# Altium project Lombardo.PrjPcb
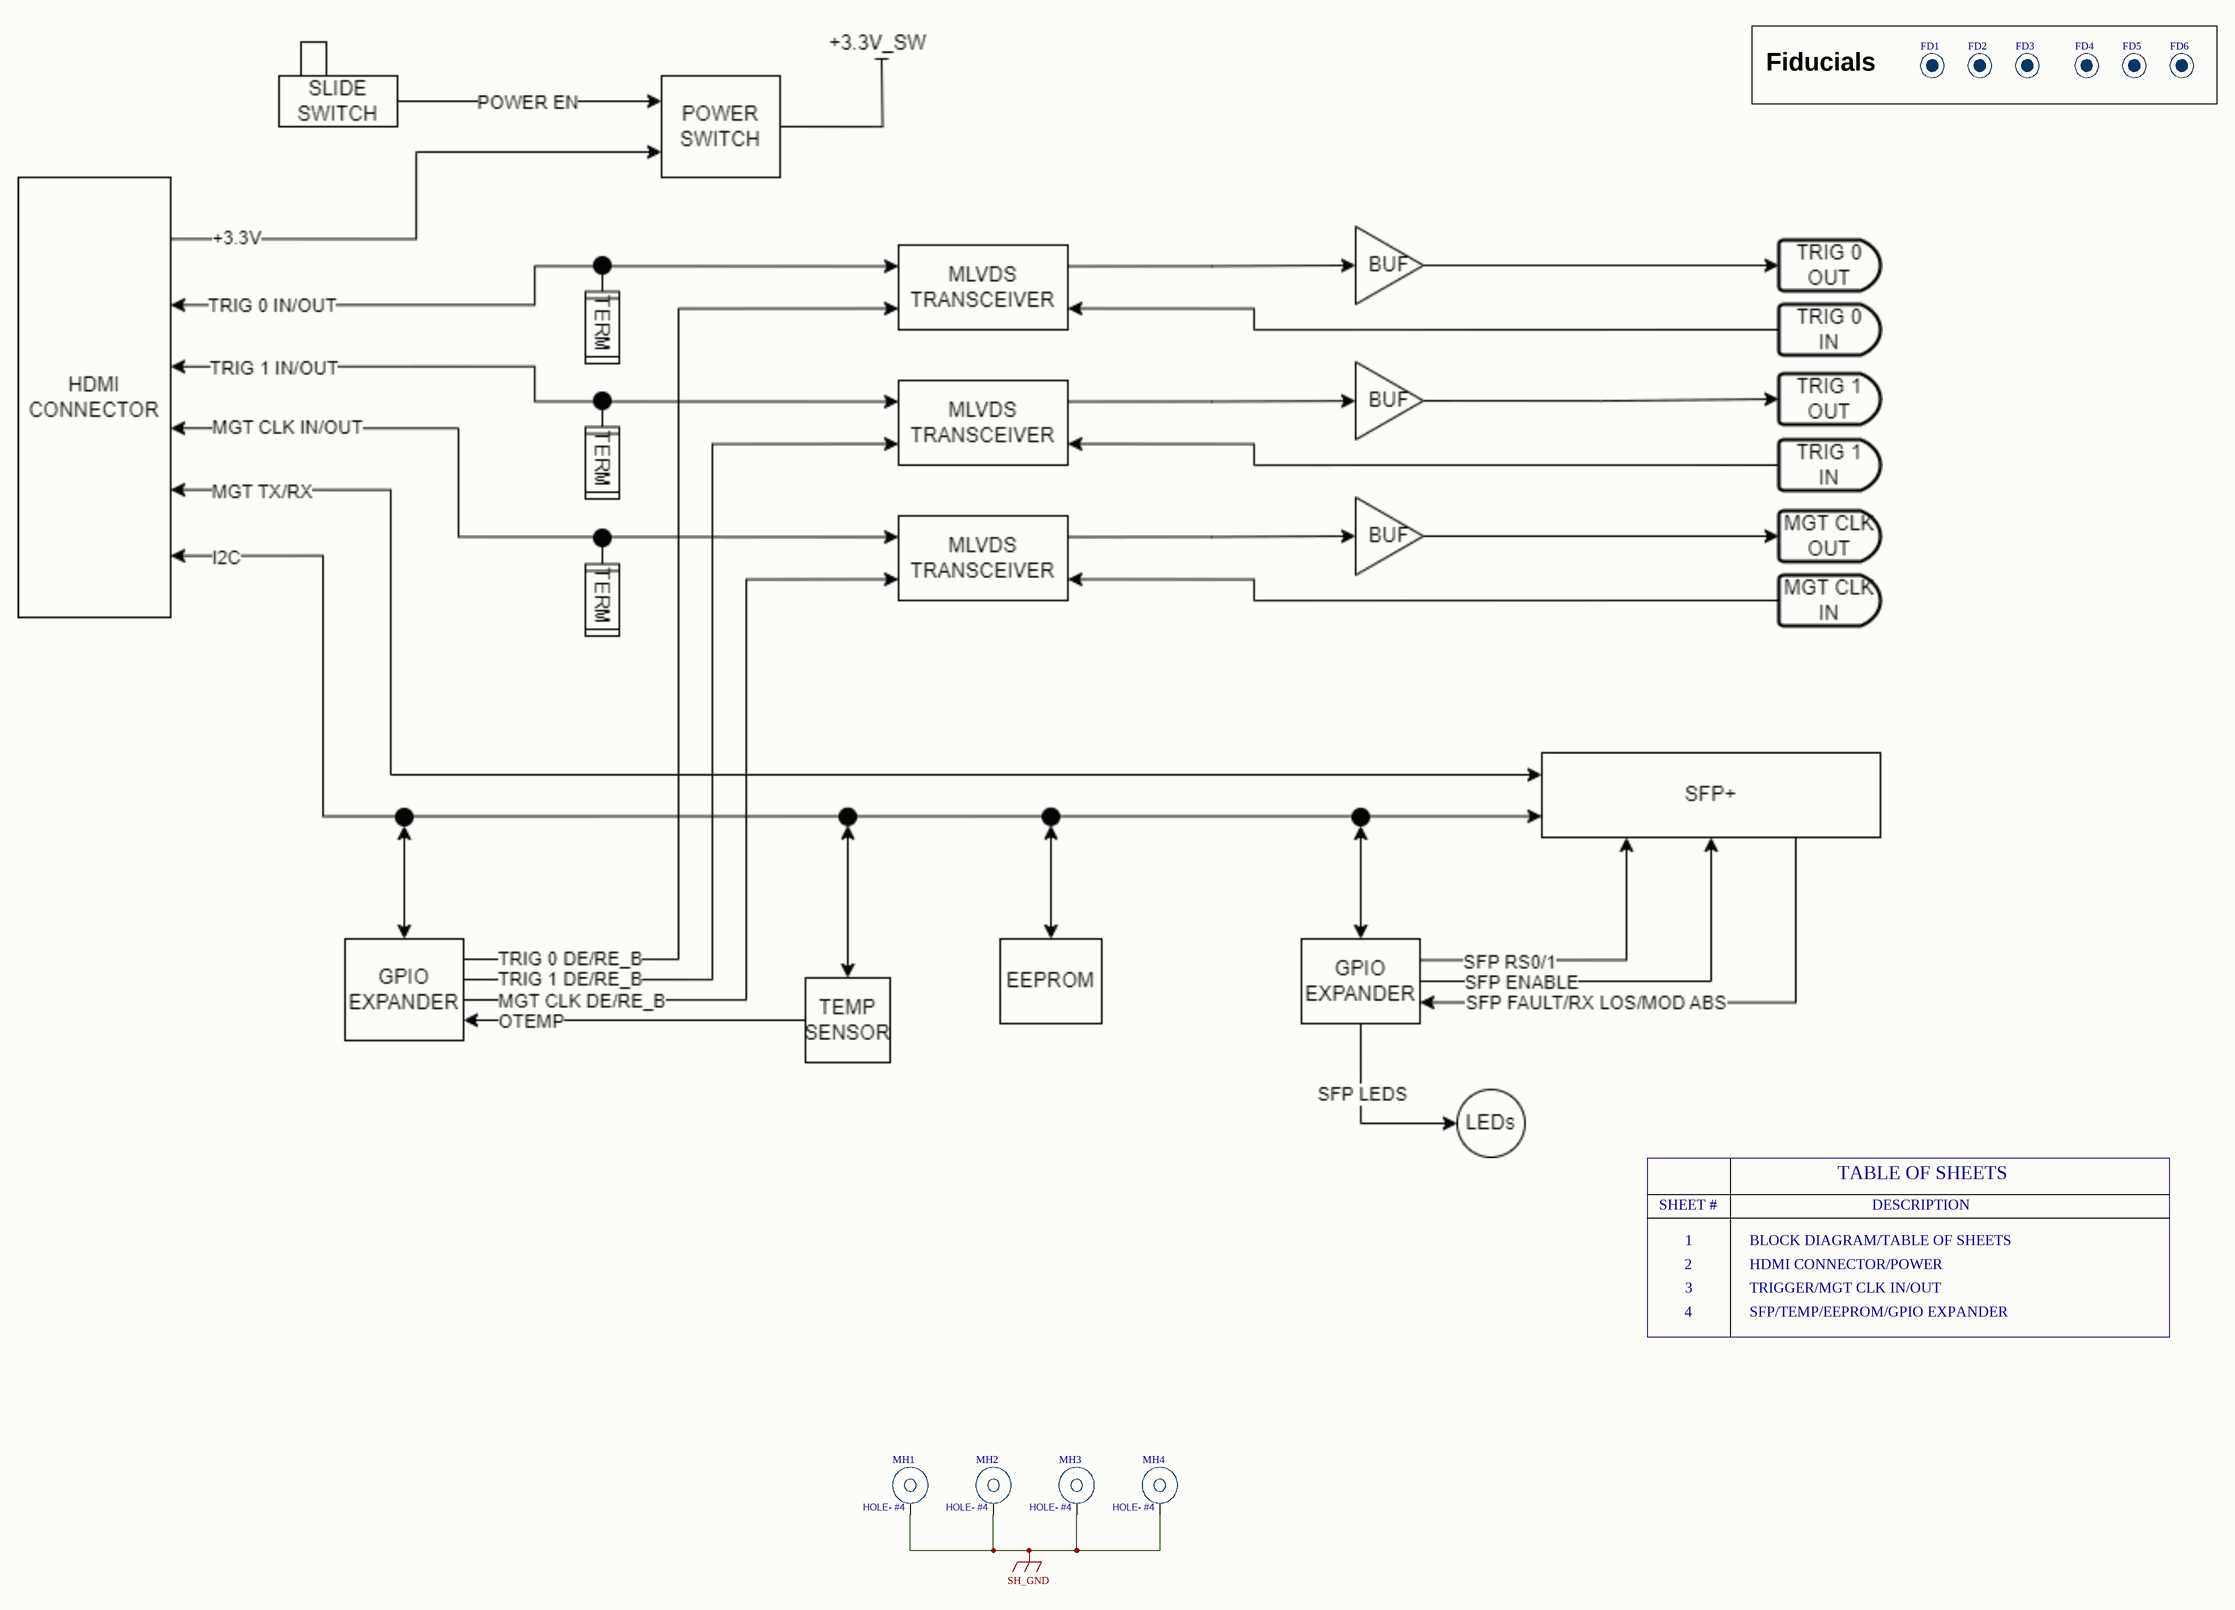
[diagram p0: BLOCK_DIAGRAM_TABLE_OF_SHEETS.SchDoc]
4 sheets, 168 parts. Net scope: global (net labels, ports and power ports of the same name join across sheets).
Board file: Lombardo_RevB.PcbDoc
Sheets:
  BLOCK_DIAGRAM_TABLE_OF_SHEETS.SchDoc
  HDMI_CONN_POWER_IN.SchDoc
  CLOCK_TRIGGER_BUF_SMA.SchDoc
  SFP_TEMP_EEPROM_GPIO.SchDoc

## Sheet BLOCK_DIAGRAM_TABLE_OF_SHEETS.SchDoc: MICRO HDMI INTERFACE
size C; CheckedBy: R. COXE; CompanyName: Atom Computing; DrawnBy: K. BARNES; Engineer: K. BARNES; Organization: Atom Computing Inc.; Address1: 918 Parker St.; Address2: Suite A-13; Address3: Berkeley, CA; Address4: 94710; DocumentNumber: 2020-07-02; Revision: B.2; SheetNumber: 1; SheetTotal: 4; PageSetup: Record=PageOptions|CenterHorizontal=True|CenterVertical=True|PrintScale=1.09|XCorrection=1.00|YCorrection=1.00|PrintKind=1|BorderSize=5000000|LeftOffset=0|BottomOffset=0|Orientation=2|PaperLength=4318|PaperWidth=2794|Scale=100|PaperSource=1025|PrintQuality=600|MediaType=256|DitherType=0|PrintScaleMode=1|PaperKind=11" x 17"|PaperIndex=17; Size: C; ReleaseYear: 2024; BoardTitle: MICRO HDMI INTERFACE; DateDrawn: 04/18/2024; DateENG: 04/18/2024; Approved1: R. COXE; DateChecked: 04/18/2024; DescriptionA: ENGINEERING RELEASE; DescriptionB: SWAP SCL/SDA ON U10, INCREASE R39 VALUE; ApprovedA: R. COXE; ApprovedB: R. COXE; DateRevisionA: 04/18/2024; DateRevisionB: 08/28/2024; RevisionA: A; RevisionB: B.1; DescriptionC: CHANGED U8 TO MAC VERSION; RevisionC: B.2; DateRevisionC: 09/26/2024; ApprovedC: R. COXE

### Parts
FD1  FIDUCIAL  [FIDUCIAL-GT]  (value not drawn)  (no BOM)
FD2  FIDUCIAL  [FIDUCIAL-GT]  (value not drawn)  (no BOM)
FD3  FIDUCIAL  [FIDUCIAL-GT]  (value not drawn)  (no BOM)
FD4  FIDUCIAL  [FIDUCIAL-GT]  (value not drawn)  (no BOM)
FD5  FIDUCIAL  [FIDUCIAL-GT]  (value not drawn)  (no BOM)
FD6  FIDUCIAL  [FIDUCIAL-GT]  (value not drawn)  (no BOM)
MH1  HOLE- #4  [HOLE - #4 screw]  (no BOM)
MH2  HOLE- #4  [HOLE - #4 screw]  (no BOM)
MH3  HOLE- #4  [HOLE - #4 screw]  (no BOM)
MH4  HOLE- #4  [HOLE - #4 screw]  (no BOM)

### Blocks framed on the sheet
Fiducials: FD1-FD6

### Nets
SH_GND: MH1.1(GND) MH2.1(GND) MH3.1(GND) MH4.1(GND)

### Notes on the sheet
- TABLE OF SHEETS
- SHEET #
- DESCRIPTION
- 2
- 3
- 1
- TRIGGER/MGT CLK IN/OUT
- HDMI CONNECTOR/POWER
- BLOCK DIAGRAM/TABLE OF SHEETS
- 4
- SFP/TEMP/EEPROM/GPIO EXPANDER
- REV
- REVISIONS
- DATE
- APPROVED
- ,
- DRAWN
- ENG
- SCHEMATIC,
- "This documentation describes Open Hardware and is licensed under the CC BY-SA 4.0. You may redistribute and modify this documentation under the terms of
- CC BY-SA 4.0. (https://creativecommons.org/licenses/by-sa/4.0/). This documentation is distributed WITHOUT ANY EXPRESS OR IMPLIED WARRANTY,
- INCLUDING OF MERCHANTABILITY, SATISFACTORY QUALITY AND FITNESS FOR A PARTICULAR PURPOSE."  COPYRIGHT ©
- Atom Computing, Inc.
- CHKD
- SIZE
- FILE NAME
- PAGE
- OF

### Library data of the parts
FD1-FD6 = CMP-00028-00000-3: Mfg: PCB FEATURE; Pins: 0; Mfg PN: FIDUCIAL
MH1-MH4 = CMP-028-00002-1: Mounting Hole for #4 screw; Mfg: NA; Case/Package: #4; Pins: 1; Mfg PN: HOLE

## Sheet HDMI_CONN_POWER_IN.SchDoc
size C; CompanyName: Atom Computing; Organization: Altium Limited; Address1: 918 Parker St.; Address2: Suite A-13; Address3: Berkeley, CA; Address4: 94710; Revision: B.2; SheetNumber: 2; SheetTotal: 4; PageSetup: Record=PageOptions|CenterHorizontal=True|CenterVertical=True|PrintScale=1.09|XCorrection=1.00|YCorrection=1.00|PrintKind=1|BorderSize=5000000|LeftOffset=0|BottomOffset=0|Orientation=2|PaperLength=4318|PaperWidth=2794|Scale=100|PaperSource=1025|PrintQuality=600|MediaType=256|DitherType=0|PrintScaleMode=1|PaperKind=11" x 17"|PaperIndex=17; Size: C; DescriptionA: ENGINEERING RELEASE; ReleaseYear: 2024; BoardTitle: MICRO HDMI INTERFACE
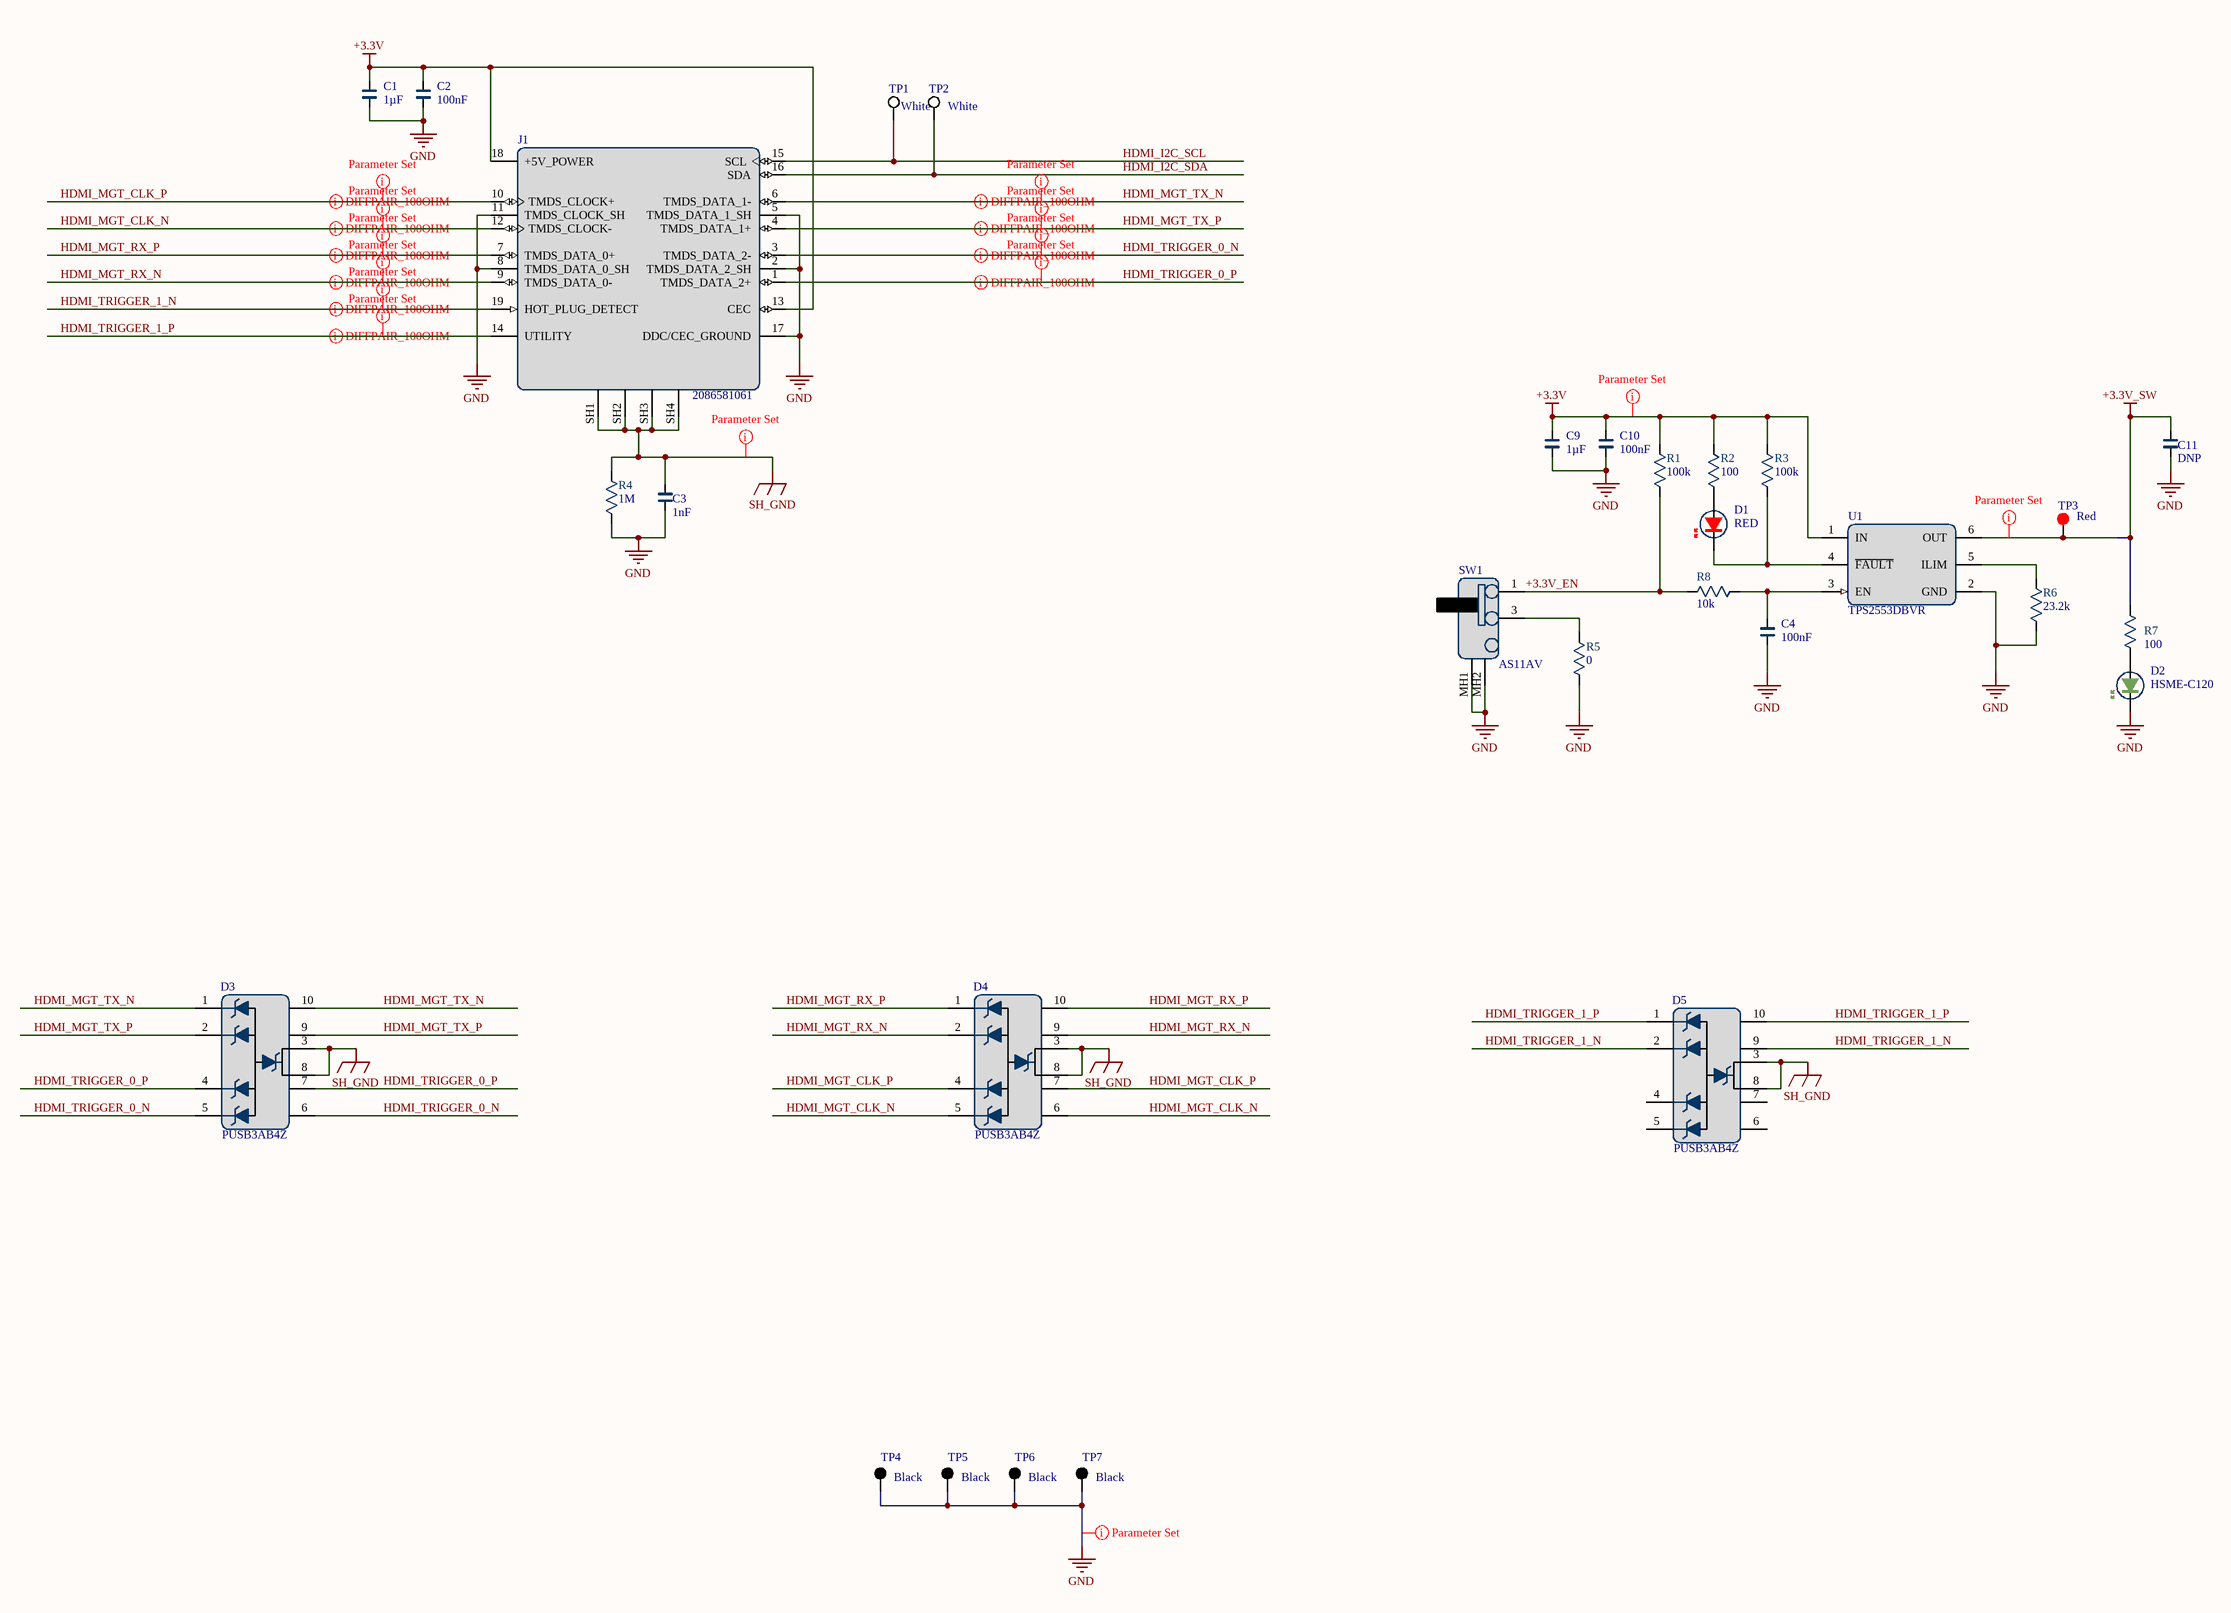
[diagram p1: HDMI_CONN_POWER_IN.SchDoc]

### Parts
C1  1µF  [CAPC160X80X95L35]
C2  100nF  [CAPC160X80X95L35]
C3  1nF  [CAPC160X80X95L35]
C4  100nF  [CAPC160X80X95L35]
C9  1µF  [CAPC160X80X95L35]
C10  100nF  [CAPC160X80X95L35]
C11  DNP  [CAPC200X125X145L50]
D1  RED  [LEDSC80X160X55L40X70_C1A2]
D2  HSME-C120  [BROADCOM_HSMX-C120]
D3  PUSB3AB4Z  [NEXPERIA_PUSB3AB4Z]
D4  PUSB3AB4Z  [NEXPERIA_PUSB3AB4Z]
D5  PUSB3AB4Z  [NEXPERIA_PUSB3AB4Z]
J1  2086581061  [MOLEX_2086581061]
R1  100k  [RESC160X85X55L30]
R2  100  [RESC160X85X55L30]
R3  100k  [RESC160X85X55L30]
R4  1M  [RESC320X160X76L51]
R5  0  [RESC160X85X55L30]
R6  23.2k  [RESC160X85X55L30]
R7  100  [RESC160X85X55L30]
R8  10k  [RESC160X85X55L30]
SW1  AS11AV  [AS11AV]
TP1  White  [Keystone_5002]
TP2  White  [Keystone_5002]
TP3  Red  [Keystone_5000]
TP4  Black  [Keystone_5001]
TP5  Black  [Keystone_5001]
TP6  Black  [Keystone_5001]
TP7  Black  [Keystone_5001]
U1  TPS2553DBVR  [SOT23-6P95_280X145L45X37]

### Nets
+3.3V: C1.1 C2.1 C9.1 C10.1 J1.13(CEC) J1.18(+5V_POWER) R1.2 R2.2 R3.2 U1.1(IN)
+3.3V_SW: C11.1 R7.2 TP3.1 U1.6(OUT)
GND: C1.2 C2.2 C3.2 C4.2 C9.2 C10.2 C11.2 D2.1 J1.2(TMDS_DATA_2_SH) J1.5(TMDS_DATA_1_SH) J1.8(TMDS_DATA_0_SH) J1.11(TMDS_CLOCK_SH) J1.17(DDC/CEC_GROUND) R4.1 R5.2 R6.1 SW1.MH1(P4) SW1.MH2(P5) TP4.1 TP5.1 TP6.1 TP7.1 U1.2(GND)
SH_GND: C3.1 D3.3 D3.8 D4.3 D4.8 D5.3 D5.8 J1.SH1(SHLD1) J1.SH2(SHLD2) J1.SH3(SHLD3) J1.SH4(SHLD4) R4.2
+3.3V_EN: R1.1 R8.1 SW1.1(P1)
HDMI_I2C_SCL: J1.15(SCL) TP1.1
HDMI_I2C_SDA: J1.16(SDA) TP2.1
HDMI_MGT_CLK_N: D4.5 D4.6 J1.12(TMDS_CLOCK-)
HDMI_MGT_CLK_P: D4.4 D4.7 J1.10(TMDS_CLOCK+)
HDMI_MGT_RX_N: D4.2 D4.9 J1.9(TMDS_DATA_0-)
HDMI_MGT_RX_P: D4.1 D4.10 J1.7(TMDS_DATA_0+)
HDMI_MGT_TX_N: D3.1 D3.10 J1.6(TMDS_DATA_1-)
HDMI_MGT_TX_P: D3.2 D3.9 J1.4(TMDS_DATA_1+)
HDMI_TRIGGER_0_N: D3.5 D3.6 J1.3(TMDS_DATA_2-)
HDMI_TRIGGER_0_P: D3.4 D3.7 J1.1(TMDS_DATA_2+)
HDMI_TRIGGER_1_N: D5.2 D5.9 J1.19(HOT_PLUG_DETECT)
HDMI_TRIGGER_1_P: D5.1 D5.10 J1.14(UTILITY)
NetC4_1: C4.1 R8.2 U1.3(EN)
NetD1_1: D1.1 R3.1 U1.4(~{FAULT})
NetD1_2: D1.2 R2.1
NetD2_2: D2.2 R7.1
NetR5_1: R5.1 SW1.3(P3)
NetR6_2: R6.2 U1.5(ILIM)

Not connected (* = marked no-connect by the designer): D5 4 5 6 7

### Layout directives
differential pair; differential pair class 100DIFF: HDMI_MGT_CLK_N, HDMI_MGT_CLK_P, HDMI_MGT_RX_N, HDMI_MGT_RX_P, HDMI_MGT_TX_N, HDMI_MGT_TX_P, HDMI_TRIGGER_0_N, HDMI_TRIGGER_0_P, HDMI_TRIGGER_1_N, HDMI_TRIGGER_1_P
net class P-G: +3.3V, +3.3V_SW, GND, SH_GND
rule Signal Stimulus [Kind - Periodic Pulse    Level - Low    Start Time = 20.00n    Stop Time = 500.0n    Period Time = 200.0n]; net class DIFFP: HDMI_MGT_CLK_P, HDMI_MGT_RX_P, HDMI_MGT_TX_P, HDMI_TRIGGER_0_P, HDMI_TRIGGER_1_P
rule Signal Stimulus [Kind - Periodic Pulse    Level - High    Start Time = 20.00n    Stop Time = 500.0n    Period Time = 200.0n]; net class DIFFN: HDMI_MGT_CLK_N, HDMI_MGT_RX_N, HDMI_MGT_TX_N, HDMI_TRIGGER_0_N, HDMI_TRIGGER_1_N

### Notes on the sheet
- SCHEMATIC,
- "This documentation describes Open Hardware and is licensed under the CC BY-SA 4.0. You may redistribute and modify this documentation under the terms of
- CC BY-SA 4.0. (https://creativecommons.org/licenses/by-sa/4.0/). This documentation is distributed WITHOUT ANY EXPRESS OR IMPLIED WARRANTY,
- INCLUDING OF MERCHANTABILITY, SATISFACTORY QUALITY AND FITNESS FOR A PARTICULAR PURPOSE."  COPYRIGHT ©
- Atom Computing, Inc.
- ,
- SIZE
- FILE NAME
- PAGE
- OF
- REV

### Library data of the parts
C1 C9 = CMP-001-00135-7: CAP CER 1uF 10V 10% 0603; Op Temp: -55°C ~ 85°C; Mfg PN: C0603C105K8PACTU; Temp Coeff: X5R; Mfg: Kemet; VALUE: 1µF; Voltage: 10V; Tolerance: 10%; Case/Package: 0603; Pins: 2
C2 C4 C10 = CMP-001-00143-7: CAP CER 0.1UF 25V X7R 0603; Tolerance: 10%; Mfg: Kemet; Mfg PN: C0603X104K3RACTU; Voltage: 25V; Temp Coeff: X7R; Case/Package: 0603; VALUE: 100nF; Pins: 2
C3 = CMP-001-00209-7: CAP CER 1000PF 50V C0G/NPO 0603; Temp Coeff: C0G/NP0; Tolerance: 5%; Mfg: Yageo; Mfg PN: CC0603JRNPO9BN102; Voltage: 50V; Case/Package: 0603; Pins: 2; VALUE: 1nF
C11 = CMP-001-00017-8: DNP, CAP 0805; VALUE: 100p; Mfg PN: DNP_CAP_0805; Mfg: DNP; Case/Package: 0805; Pins: 2
D1 = CMP-004-00024-2: LED RED CLEAR CHIP SMD 629nm, 1.9V, 0603; Mfg PN: LTST-C193KRKT-2A; Mfg: Lite-On Inc.; Current Rating: 30mA; Voltage: 2V; Op Temp: -55°C ~ 85°C; Value: RED; Pins: 2; Case/Package: 0603
D2 = CMP-004-00020-5: LED GREEN CLEAR CHIP SMD R/A; Mfg: AVAGO TECHNOLOGIES; Forward Voltage: 2.1V; Mfg PN: HSME-C120; Value: GREEN; Pins: 2; Case/Package: 2-SMD; Mounting Technology: Surface Mount; Nominal Vf: 2.1V; RoHS Compliant: Yes
D3-D5 = CMP-0037-00001-1: TVS DIODE BIDIRECTIONAL 3.3VWM 5VC DFN2510A-10; Mfg: Nexperia USA Inc.; Voltage - Clamping: 5V; Current - Peak Pulse: 7A (8/20µs); Voltage - Reverse Standoff: 3.3V; Voltage - Breakdown: 5.5V; Max Operating Temperature: 85°C; Pins: 10; Mounting Technology: Surface Mount; Mfg PN: PUSB3AB4Z; Case/Package: 10-XFDFN; RoHS Compliant: Yes; Min Operating Temperature: -40°C
J1 = CMP-002-00061-4: HDMI 2.1 Receptacle Connector 19 Position Surface Mount, Right Angle; Through Hole; Mfg: Molex; Max Current Rating: 500mA; Voltage Rating: 40V; Gender: Female; Pins: 23; RoHS Compliant: Yes; Mfg PN: 2086581061; Min Operating Temperature: -20°C; Max Operating Temperature: 85°C; Case/Package: SMD-RA; Mounting Technology: Surface Mount/Through Hole; Connector Type: HDMI
R1 = CMP-009-00291-2: RES SMD 100K OHM 1% 1/10W 0603; Mfg PN: RC0603FR-07100KL; Mfg: Yageo; Case/Package: 0603; VALUE: 100k; Pins: 2
R2 R7 = CMP-009-00467-2: RES SMD 100 OHM 1% 1/10W 0603; Mfg PN: ERJ-3EKF1000V; Mfg: Panasonic Electronic Components; Power: 100mW; VALUE: 100; Tolerance: 1%; Max Operating Temperature: 155°C; Case/Package: 0603; RoHS Compliant: Yes; Pins: 2; Min Operating Temperature: -55°C; Mounting Technology: Surface Mount
R3 = CMP-009-00291-2: RES SMD 100K OHM 1% 1/10W 0603; Mfg: Yageo; Mfg PN: RC0603FR-07100KL; Pins: 2; VALUE: 100k; Case/Package: 0603
R4 = CMP-009-00313-1: 1 ±1% 0.25W, 1/4W Chip Resistor 1206 (3216 Metric) High Voltage Thick Film; Mfg PN: RCV12061M00FKEA; Mfg: Vishay Dale; VALUE: 1M; Case/Package: 1206; Pins: 2
R5 = CMP-009-00290-2: RES 0 OHM JUMPER 1/10W 0603; Mfg PN: RC0603FR-070RL; Mfg: Yageo; Case/Package: 0603; VALUE: 0; Pins: 2
R6 = CMP-009-00553-1: RES SMD 23.2K OHM 1% 1/10W 0603; Power: 100mW; Mfg: Panasonic Electronic Components; Mfg PN: ERJ-3EKF2322V; VALUE: 23.2k; Tolerance: 1%; Pins: 2; Min Operating Temperature: -55°C; RoHS Compliant: Yes; Max Operating Temperature: 155°C; Case/Package: 0603; Mounting Technology: Surface Mount
R8 = CMP-009-00475-2: RES SMD 10K OHM 1% 1/10W 0603; Mfg: Panasonic Electronic Components; Mfg PN: ERJ-3EKF1002V; Power: 100mW; VALUE: 10k; Case/Package: 0603; RoHS Compliant: Yes; Pins: 2; Max Operating Temperature: 155°C; Min Operating Temperature: -55°C; Tolerance: 1%; Mounting Technology: Surface Mount
SW1 = CMP-011-00000-3: SWITCH SLIDE SPST 0.4VA 28V Through Hole, Right Angle, Vertical; Mfg: NKK Switches; Op Temp: -30°C ~ 85°C; Current Rating: 100mA; Pins: 3; Mfg PN: AS11AV; Case/Package: .100" TH-RA; Voltage: 28V
TP1 TP2 = CMP-00030-00002-6: Test Point, White, 1-Pin THD, RoHS, Bulk; Mfg PN: 5002; Mfg: Keystone; Pins: 1; Value: White
TP3 = CMP-00030-00000-6: Test Point, Red, 1-Pin THD, RoHS, Bulk; Mfg: Keystone; Mfg PN: 5000; Value: Red; Pins: 1
TP4-TP7 = CMP-00030-00001-5: Test Point, Black, 1-Pin THD, RoHS, Bulk; Mfg PN: 5001; Mfg: Keystone; Value: Black; Pins: 1
U1 = CMP-035-00004-3: Power Switch/Driver 1:1 N-Channel 1.5A SOT-23-6; Min Supply Voltage: 2.5V; Max Supply Voltage: 6.5V; Mfg: Texas Instruments; RoHS Compliant: Yes; Mfg PN: TPS2553DBVR; Pins: 6; Output Current: 1.5A; Mounting Technology: Surface Mount; Case/Package: SOT-23-6; Max Operating Temperature: 85°C; Min Operating Temperature: -40°C

## Sheet CLOCK_TRIGGER_BUF_SMA.SchDoc
size C; CompanyName: Atom Computing; Organization: Altium Limited; Address1: 918 Parker St.; Address2: Suite A-13; Address3: Berkeley, CA; Address4: 94710; Revision: B.2; SheetNumber: 3; SheetTotal: 4; PageSetup: Record=PageOptions|CenterHorizontal=True|CenterVertical=True|PrintScale=1.09|XCorrection=1.00|YCorrection=1.00|PrintKind=1|BorderSize=5000000|LeftOffset=0|BottomOffset=0|Orientation=2|PaperLength=4318|PaperWidth=2794|Scale=100|PaperSource=1025|PrintQuality=600|MediaType=256|DitherType=0|PrintScaleMode=1|PaperKind=11" x 17"|PaperIndex=17; Size: C; DescriptionA: ENGINEERING RELEASE; ReleaseYear: 2024; BoardTitle: MICRO HDMI INTERFACE
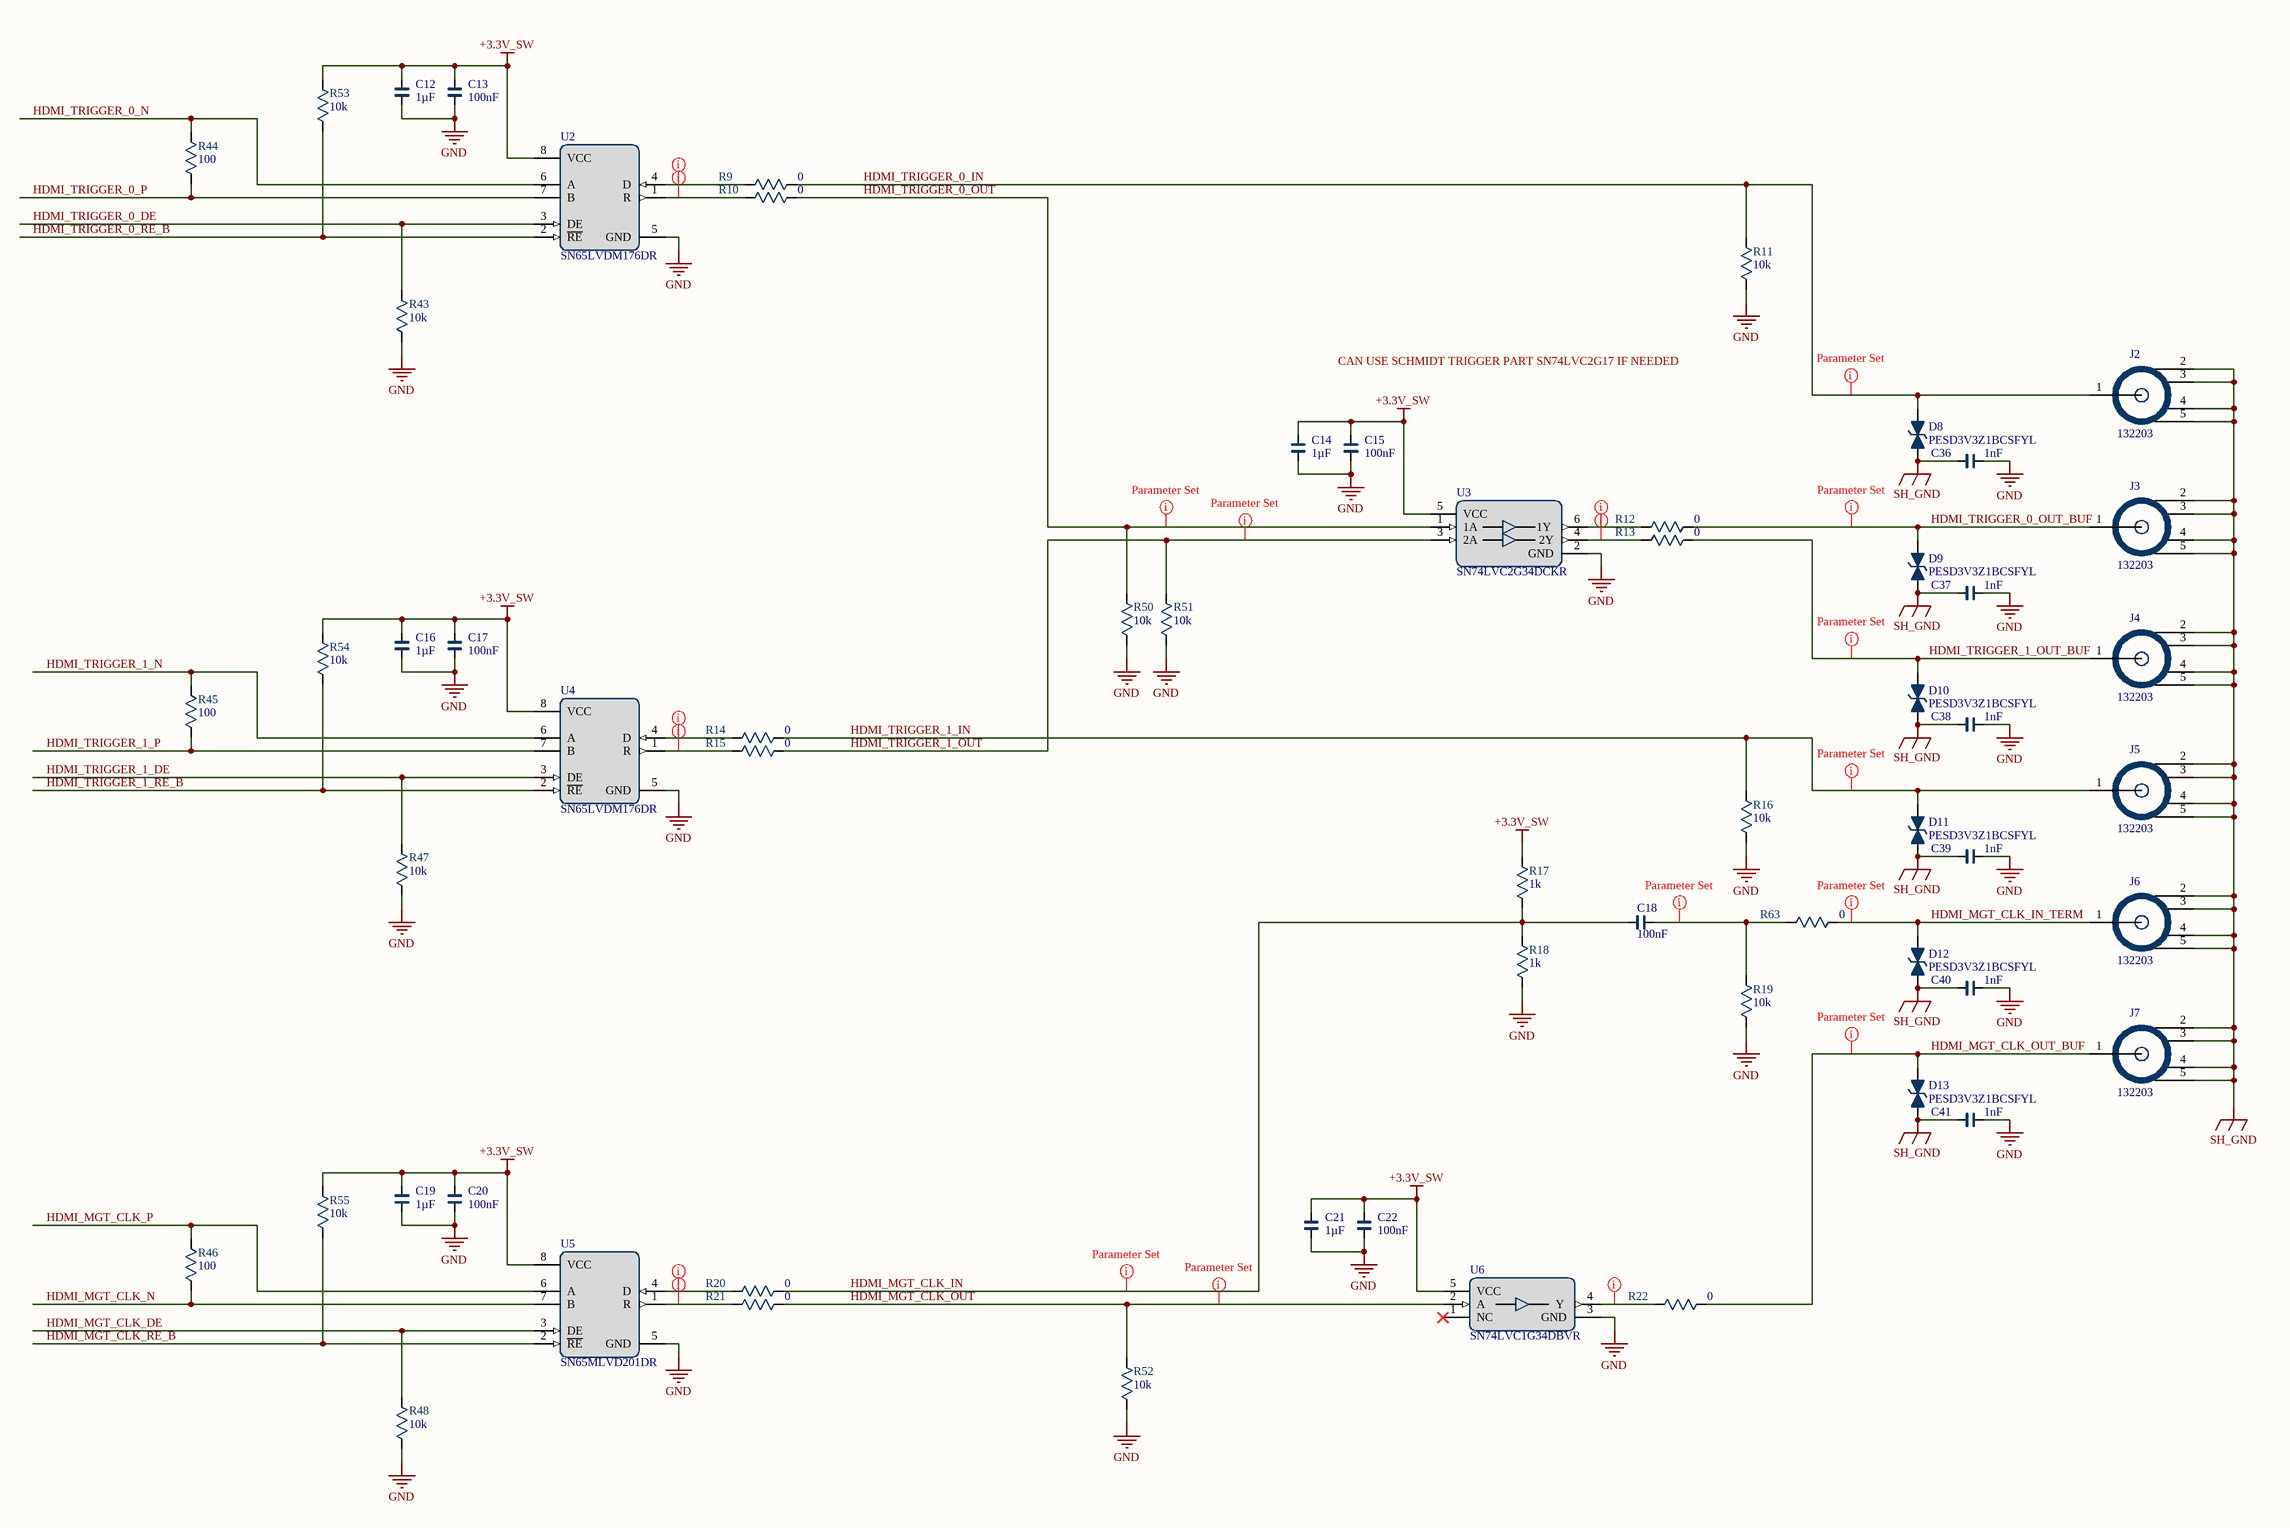
[diagram p2: CLOCK_TRIGGER_BUF_SMA.SchDoc]

### Parts
C12  1µF  [CAPC160X80X95L35]
C13  100nF  [CAPC160X80X95L35]
C14  1µF  [CAPC160X80X95L35]
C15  100nF  [CAPC160X80X95L35]
C16  1µF  [CAPC160X80X95L35]
C17  100nF  [CAPC160X80X95L35]
C18  100nF  [CAPC160X80X95L35]
C19  1µF  [CAPC160X80X95L35]
C20  100nF  [CAPC160X80X95L35]
C21  1µF  [CAPC160X80X95L35]
C22  100nF  [CAPC160X80X95L35]
C36  1nF  [CAPC160X80X95L35]
C37  1nF  [CAPC160X80X95L35]
C38  1nF  [CAPC160X80X95L35]
C39  1nF  [CAPC160X80X95L35]
C40  1nF  [CAPC160X80X95L35]
C41  1nF  [CAPC160X80X95L35]
D8  PESD3V3Z1BCSFYL  [DIO_PESD5V0R1BSFYL]
D9  PESD3V3Z1BCSFYL  [DIO_PESD5V0R1BSFYL]
D10  PESD3V3Z1BCSFYL  [DIO_PESD5V0R1BSFYL]
D11  PESD3V3Z1BCSFYL  [DIO_PESD5V0R1BSFYL]
D12  PESD3V3Z1BCSFYL  [DIO_PESD5V0R1BSFYL]
D13  PESD3V3Z1BCSFYL  [DIO_PESD5V0R1BSFYL]
J2  132203  [Amphenol_132203]
J3  132203  [Amphenol_132203]
J4  132203  [Amphenol_132203]
J5  132203  [Amphenol_132203]
J6  132203  [Amphenol_132203]
J7  132203  [Amphenol_132203]
R9  0  [RESC160X85X55L30]
R10  0  [RESC160X85X55L30]
R11  10k  [RESC160X85X55L30]
R12  0  [RESC160X85X55L30]
R13  0  [RESC160X85X55L30]
R14  0  [RESC160X85X55L30]
R15  0  [RESC160X85X55L30]
R16  10k  [RESC160X85X55L30]
R17  1k  [RESC160X85X55L30]
R18  1k  [RESC160X85X55L30]
R19  10k  [RESC160X85X55L30]
R20  0  [RESC160X85X55L30]
R21  0  [RESC160X85X55L30]
R22  0  [RESC160X85X55L30]
R43  10k  [RESC160X85X55L30]
R44  100  [RESC160X85X55L30]
R45  100  [RESC160X85X55L30]
R46  100  [RESC160X85X55L30]
R47  10k  [RESC160X85X55L30]
R48  10k  [RESC160X85X55L30]
R50  10k  [RESC160X85X55L30]
R51  10k  [RESC160X85X55L30]
R52  10k  [RESC160X85X55L30]
R53  10k  [RESC160X85X55L30]
R54  10k  [RESC160X85X55L30]
R55  10k  [RESC160X85X55L30]
R63  0  [RESC160X85X55L30]
U2  SN65LVDM176DR  [SOIC8P127_490X599X175L84X41]
U3  SN74LVC2G34DCKR  [SOT23-6P65_210X110L36X23]
U4  SN65LVDM176DR  [SOIC8P127_490X599X175L84X41]
U5  SN65MLVD201DR  [SOIC8P127_490X599X175L84X41]
U6  SN74LVC1G34DBVR  [SOT23-5P95_280X110L45X40]

### Nets
+3.3V_SW: C12.1 C13.1 C14.1 C15.1 C16.1 C17.1 C19.1 C20.1 C21.1 C22.1 R17.2 R53.2 R54.2 R55.2 U2.8(VCC) U3.5(VCC) U4.8(VCC) U5.8(VCC) U6.5(VCC)
GND: C12.2 C13.2 C14.2 C15.2 C16.2 C17.2 C19.2 C20.2 C21.2 C22.2 C36.1 C37.1 C38.1 C39.1 C40.1 C41.1 R11.1 R16.1 R18.1 R19.1 R43.1 R47.1 R48.1 R50.1 R51.1 R52.1 U2.5(GND) U3.2(GND) U4.5(GND) U5.5(GND) U6.3(GND)
SH_GND: C36.2 C37.2 C38.2 C39.2 C40.2 C41.2 D8.1 D9.1 D10.1 D11.1 D12.1 D13.1 J2.2(GND) J2.3(GND) J2.4(GND) J2.5(GND) J3.2(GND) J3.3(GND) J3.4(GND) J3.5(GND) J4.2(GND) J4.3(GND) J4.4(GND) J4.5(GND) J5.2(GND) J5.3(GND) J5.4(GND) J5.5(GND) J6.2(GND) J6.3(GND) J6.4(GND) J6.5(GND) J7.2(GND) J7.3(GND) J7.4(GND) J7.5(GND)
HDMI_MGT_CLK_DE: R48.2 U5.3(DE)
HDMI_MGT_CLK_IN: C18.1 R17.1 R18.2 R20.2
HDMI_MGT_CLK_IN_TERM: D12.2 J6.1(RF) R63.2
HDMI_MGT_CLK_N: R46.1 U5.7(B)
HDMI_MGT_CLK_OUT: R21.2 R52.2 U6.2(A)
HDMI_MGT_CLK_OUT_BUF: D13.2 J7.1(RF) R22.2
HDMI_MGT_CLK_P: R46.2 U5.6(A)
HDMI_MGT_CLK_RE_B: R55.1 U5.2(~{RE})
HDMI_TRIGGER_0_DE: R43.2 U2.3(DE)
HDMI_TRIGGER_0_IN: D8.2 J2.1(RF) R9.2 R11.2
HDMI_TRIGGER_0_N: R44.2 U2.6(A)
HDMI_TRIGGER_0_OUT: R10.2 R50.2 U3.1(1A)
HDMI_TRIGGER_0_OUT_BUF: D9.2 J3.1(RF) R12.2
HDMI_TRIGGER_0_P: R44.1 U2.7(B)
HDMI_TRIGGER_0_RE_B: R53.1 U2.2(~{RE})
HDMI_TRIGGER_1_DE: R47.2 U4.3(DE)
HDMI_TRIGGER_1_IN: D11.2 J5.1(RF) R14.2 R16.2
HDMI_TRIGGER_1_N: R45.2 U4.6(A)
HDMI_TRIGGER_1_OUT: R15.2 R51.2 U3.3(2A)
HDMI_TRIGGER_1_OUT_BUF: D10.2 J4.1(RF) R13.2
HDMI_TRIGGER_1_P: R45.1 U4.7(B)
HDMI_TRIGGER_1_RE_B: R54.1 U4.2(~{RE})
NetC18_2: C18.2 R19.2 R63.1
NetR9_1: R9.1 U2.4(D)
NetR10_1: R10.1 U2.1(R)
NetR12_1: R12.1 U3.6(1Y)
NetR13_1: R13.1 U3.4(2Y)
NetR14_1: R14.1 U4.4(D)
NetR15_1: R15.1 U4.1(R)
NetR20_1: R20.1 U5.4(D)
NetR21_1: R21.1 U5.1(R)
NetR22_1: R22.1 U6.4(Y)

Not connected (* = marked no-connect by the designer): U6 1(NC)*

### Layout directives
net class 50OHM: HDMI_MGT_CLK_IN, HDMI_MGT_CLK_IN_TERM, HDMI_MGT_CLK_OUT, HDMI_MGT_CLK_OUT_BUF, HDMI_TRIGGER_0_IN, HDMI_TRIGGER_0_OUT, HDMI_TRIGGER_0_OUT_BUF, HDMI_TRIGGER_1_IN, HDMI_TRIGGER_1_OUT, HDMI_TRIGGER_1_OUT_BUF, NetC18_2, NetR9_1, NetR10_1, NetR12_1, NetR13_1, NetR14_1, NetR15_1, NetR20_1, NetR21_1, NetR22_1

### Notes on the sheet
- CAN USE SCHMIDT TRIGGER PART SN74LVC2G17 IF NEEDED
- SCHEMATIC,
- "This documentation describes Open Hardware and is licensed under the CC BY-SA 4.0. You may redistribute and modify this documentation under the terms of
- CC BY-SA 4.0. (https://creativecommons.org/licenses/by-sa/4.0/). This documentation is distributed WITHOUT ANY EXPRESS OR IMPLIED WARRANTY,
- INCLUDING OF MERCHANTABILITY, SATISFACTORY QUALITY AND FITNESS FOR A PARTICULAR PURPOSE."  COPYRIGHT ©
- Atom Computing, Inc.
- ,
- SIZE
- FILE NAME
- PAGE
- OF
- REV

### Library data of the parts
C12 C14 C16 C19 C21 = CMP-001-00135-7: as C1 on sheet HDMI_CONN_POWER_IN; VALUE: 1µF; Voltage: 10V; Tolerance: 10%; Case/Package: 0603; Pins: 2
C13 C15 C17 C18 C20 C22 = CMP-001-00143-7: as C2 on sheet HDMI_CONN_POWER_IN; Voltage: 25V; Temp Coeff: X7R; Case/Package: 0603; VALUE: 100nF; Pins: 2
C36-C41 = CMP-001-00209-7: as C3 on sheet HDMI_CONN_POWER_IN; Voltage: 50V; Case/Package: 0603; Pins: 2; VALUE: 1nF
D8-D13 = CMP-037-00000-1: TVS DIODE 3.3VWM 4.8VC DSN0603-2; Voltage-Clamping: 4.8V; Voltage-Reverse Standoff: 3.3V; Mfg: Nexperia USA Inc.; Voltage-Breakdown: 6.8V; Current-Peak Pulse: 15A (8/20µs); RoHS Compliant: Yes; Max Operating Temperature: 125°C; Case/Package: 0201; Pins: 2; Min Operating Temperature: -40°C; Mfg PN: PESD3V3Z1BCSFYL; Mounting Technology: Surface Mount
J2-J7 = CMP-002-00003-3: Conn; RF; SMA Rt Angle PCB Jack Thru Hole 50 Ohm Bulkhead; Mfg: Amphenol RF; Case/Package: SMA RA; Mfg PN: 132203; Pins: 5
R9 R10 R12-R15 R20-R22 R63 = CMP-009-00290-2: as R5 on sheet HDMI_CONN_POWER_IN; Case/Package: 0603; Pins: 2; VALUE: 0
R11 R16 R19 R43 R47 R48 R50-R55 = CMP-009-00475-2: RES SMD 10K OHM 1% 1/10W 0603; Power: 100mW; Mfg PN: ERJ-3EKF1002V; Mfg: Panasonic Electronic Components; Mounting Technology: Surface Mount; RoHS Compliant: Yes; Case/Package: 0603; Min Operating Temperature: -55°C; VALUE: 10k; Max Operating Temperature: 155°C; Tolerance: 1%; Pins: 2
R17 R18 = CMP-009-00295-2: RES SMD 1K OHM 1% 1/10W 0603; Mfg PN: RC0603FR-071KL; Mfg: Yageo; VALUE: 1k; Case/Package: 0603; Pins: 2
R44-R46 = CMP-009-00467-2: RES SMD 100 OHM 1% 1/10W 0603; Power: 100mW; Mfg PN: ERJ-3EKF1000V; Mfg: Panasonic Electronic Components; VALUE: 100; Pins: 2; Case/Package: 0603; RoHS Compliant: Yes; Mounting Technology: Surface Mount; Tolerance: 1%; Min Operating Temperature: -55°C; Max Operating Temperature: 155°C
U2 U4 = CMP-015-00015-3: 1/1 Transceiver Half LVDS 8-SOIC; Max Supply Voltage: 3.6V; Mfg: Texas Instruments; Nominal Supply Voltage: 3.3V; Min Supply Voltage: 3V; Mfg PN: SN65LVDM176DR; Max Operating Temperature: 85°C; Min Operating Temperature: -40°C; Pins: 8; Case/Package: SOP; RoHS Compliant: Yes; Mounting Technology: Surface Mount
U3 = CMP-016-00001-4: Buffer, Non-Inverting 2 Element 1 Bit per Element Push-Pull Output SC-70-6; Min Supply Voltage: 1.65V; Frequency: 125MHz; Mfg: Texas Instruments; Max Supply Voltage: 5.5V; Min Operating Temperature: -40°C; Logic Type: Buffer; Mfg PN: SN74LVC2G34DCKR; Pins: 6; RoHS Compliant: Yes; Mounting Technology: Surface Mount; Max Operating Temperature: 125°C; Case/Package: SC-70-6
U5 = CMP-015-00016-3: 1/1 Transceiver Half LVDS, Multipoint 8-SOIC; Max Supply Voltage: 3.6V; Min Supply Voltage: 3V; Nominal Supply Voltage: 3.3V; Mfg: Texas Instruments; Max Operating Temperature: 85°C; RoHS Compliant: Yes; Pins: 8; Case/Package: SOP; Min Operating Temperature: -40°C; Mfg PN: SN65MLVD201DR; Mounting Technology: Surface Mount
U6 = CMP-016-00004-1: Buffer, Non-Inverting 1 Element 1 Bit per Element Push-Pull Output SOT-23-5; Max Supply Voltage: 5.5V; Mfg: Texas Instruments; Min Supply Voltage: 1.65V; Nominal Supply Voltage: 3.3V; Pins: 5; RoHS Compliant: Yes; Output Function: Buffer, Non-Inverting; Logic Type: BUFFER; Case/Package: LSSOP; Mounting Technology: Surface Mount; Max Operating Temperature: 125°C; Min Operating Temperature: -40°C; Mfg PN: SN74LVC1G34DBVR

## Sheet SFP_TEMP_EEPROM_GPIO.SchDoc
size C; CompanyName: Atom Computing; Organization: Altium Limited; Address1: 918 Parker St.; Address2: Suite A-13; Address3: Berkeley, CA; Address4: 94710; Revision: B.2; SheetNumber: 4; SheetTotal: 4; PageSetup: Record=PageOptions|CenterHorizontal=True|CenterVertical=True|PrintScale=1.09|XCorrection=1.00|YCorrection=1.00|PrintKind=1|BorderSize=5000000|LeftOffset=0|BottomOffset=0|Orientation=2|PaperLength=4318|PaperWidth=2794|Scale=100|PaperSource=1025|PrintQuality=600|MediaType=256|DitherType=0|PrintScaleMode=1|PaperKind=11" x 17"|PaperIndex=17; Size: C; DescriptionA: ENGINEERING RELEASE; ReleaseYear: 2024; BoardTitle: MICRO HDMI INTERFACE
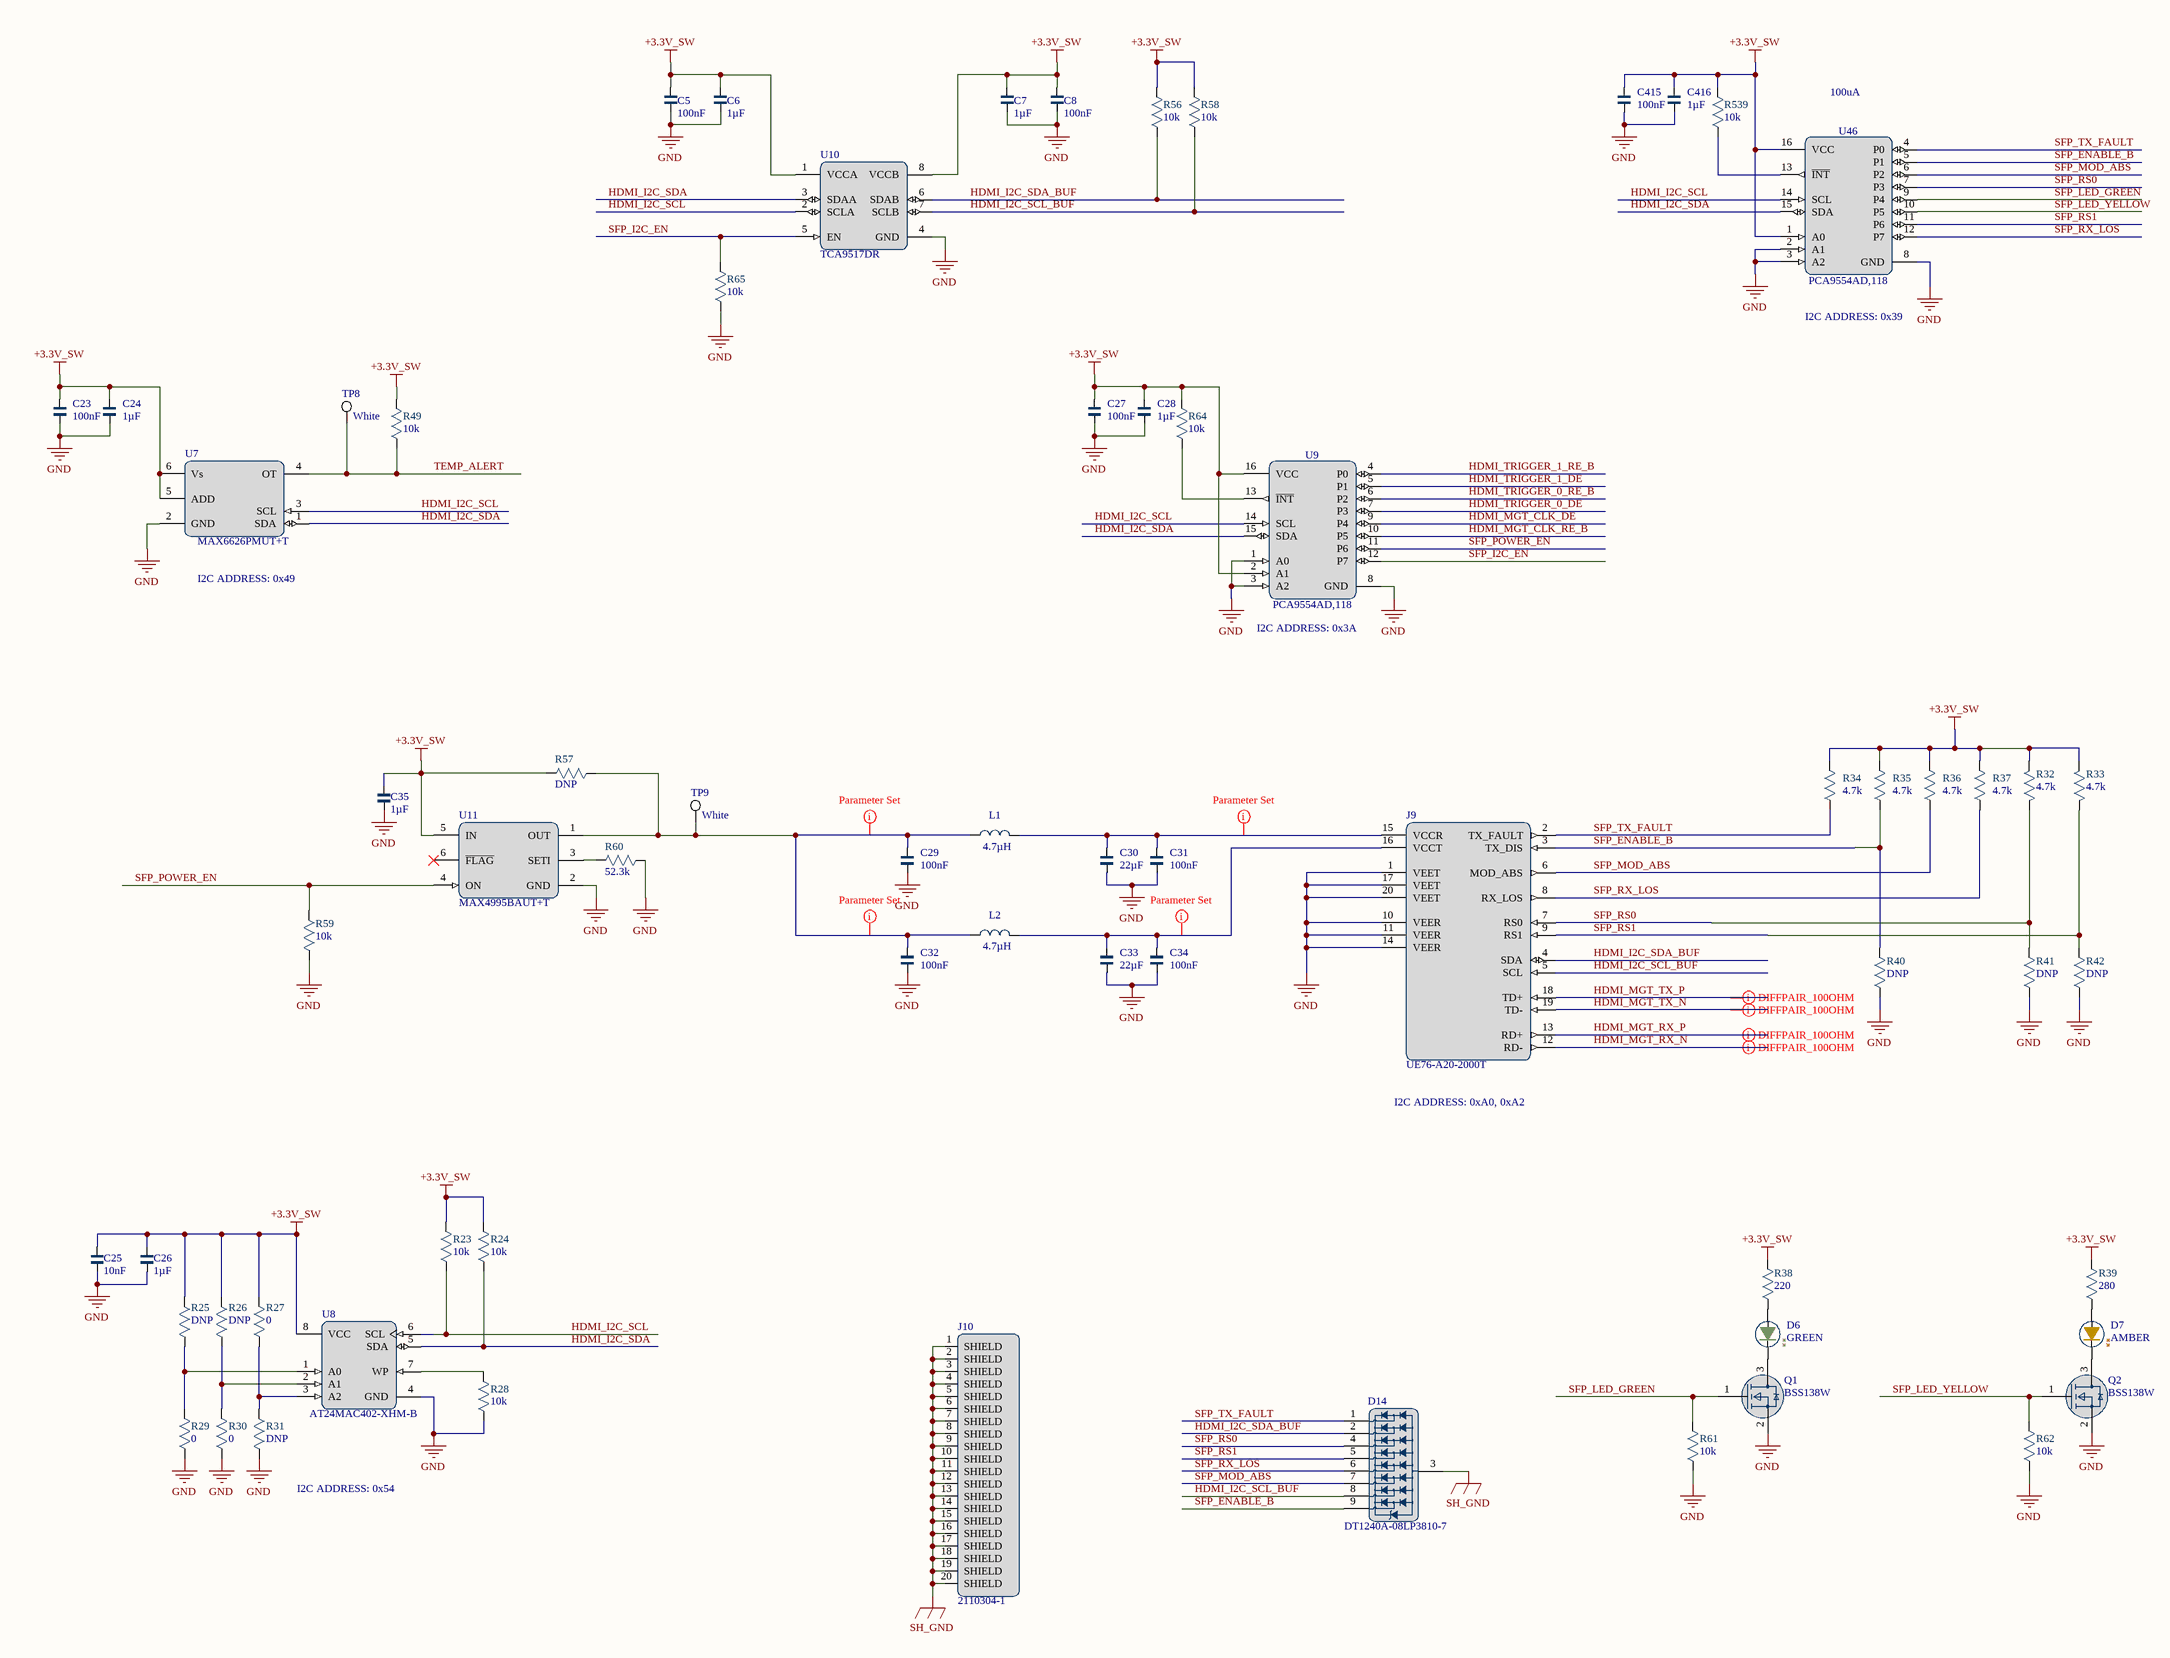
[diagram p3: SFP_TEMP_EEPROM_GPIO.SchDoc]

### Parts
C5  100nF  [CAPC160X80X95L35]
C6  1µF  [CAPC160X80X95L35]
C7  1µF  [CAPC160X80X95L35]
C8  100nF  [CAPC160X80X95L35]
C23  100nF  [CAPC160X80X95L35]
C24  1µF  [CAPC160X80X95L35]
C25  10nF  [CAPC160X80X95L35]
C26  1µF  [CAPC160X80X95L35]
C27  100nF  [CAPC160X80X95L35]
C28  1µF  [CAPC160X80X95L35]
C29  100nF  [CAPC160X80X95L35]
C30  22µF  [CAPC320X160X90L50]
C31  100nF  [CAPC160X80X95L35]
C32  100nF  [CAPC160X80X95L35]
C33  22µF  [CAPC320X160X90L50]
C34  100nF  [CAPC160X80X95L35]
C35  1µF  [CAPC160X80X95L35]
C415  100nF  [CAPC160X80X95L35]
C416  1µF  [CAPC160X80X95L35]
D6  GREEN  [BROADCOM_HSMX-C120]
D7  AMBER  [BROADCOM_HSMX-C120]
D14  DT1240A-08LP3810-7  [DIODES_DT1240A-08LP3810-7]
J9  UE76-A20-2000T  [AMPHENOL_UX76-A20-X00XX]
J10  2110304-1  [TE_2110304-1_NO_KEEPOUT]
L1  4.7µH  [VISHAY_IHLP-2020BZ]
L2  4.7µH  [VISHAY_IHLP-2020BZ]
Q1  BSS138W  [SOT23-3P65_210X110L36X22]
Q2  BSS138W  [SOT23-3P65_210X110L36X22]
R23  10k  [RESC160X85X55L30]
R24  10k  [RESC160X85X55L30]
R25  DNP  [RESC160X85X55L30]
R26  DNP  [RESC160X85X55L30]
R27  0  [RESC160X85X55L30]
R28  10k  [RESC160X85X55L30]
R29  0  [RESC160X85X55L30]
R30  0  [RESC160X85X55L30]
R31  DNP  [RESC160X85X55L30]
R32  4.7k  [RESC160X85X55L30]
R33  4.7k  [RESC160X85X55L30]
R34  4.7k  [RESC160X85X55L30]
R35  4.7k  [RESC160X85X55L30]
R36  4.7k  [RESC160X85X55L30]
R37  4.7k  [RESC160X85X55L30]
R38  220  [RESC160X85X55L30]
R39  280  [RESC160X85X55L30]
R40  DNP  [RESC160X85X55L30]
R41  DNP  [RESC160X85X55L30]
R42  DNP  [RESC160X85X55L30]
R49  10k  [RESC160X85X55L30]
R56  10k  [RESC160X85X55L30]
R57  DNP  [RESC160X85X55L30]
R58  10k  [RESC160X85X55L30]
R59  10k  [RESC160X85X55L30]
R60  52.3k  [RESC160X85X55L30]
R61  10k  [RESC160X85X55L30]
R62  10k  [RESC160X85X55L30]
R64  10k  [RESC160X85X55L30]
R65  10k  [RESC160X85X55L30]
R539  10k  [RESC160X85X55L30]
TP8  White  [Keystone_5002]
TP9  White  [Keystone_5002]
U7  MAX6626PMUT+T  [SOT23-6P95_280X145L45X42]
U8  AT24MAC402-XHM-B  [SOP8P65_300X640X120L60X24]
U9  PCA9554AD,118  [SOIC16P127_1030X1032X265L83X42]
U10  TCA9517DR  [SOIC8P127_490X599X175L84X41]
U11  MAX4995BAUT+T  [SOT23-6P95_280X145L45X42]
U46  PCA9554AD,118  [SOIC16P127_1030X1032X265L83X42]

### Nets
+3.3V_SW: C5.1 C6.1 C7.1 C8.1 C23.1 C24.1 C25.1 C26.1 C27.1 C28.1 C35.1 C415.1 C416.2 R23.2 R24.2 R25.1 R26.1 R27.2 R32.2 R33.2 R34.2 R35.2 R36.2 R37.2 R38.2 R39.2 R49.2 R56.2 R57.2 R58.2 R64.2 R539.2 U7.5(ADD) U7.6(Vs) U8.8(VCC) U9.2(A1) U9.16(VCC) U10.1(VCCA) U10.8(VCCB) U11.5(IN) U46.1(A0) U46.16(VCC)
GND: C5.2 C6.2 C7.2 C8.2 C23.2 C24.2 C25.2 C26.2 C27.2 C28.2 C29.2 C30.2 C31.2 C32.2 C33.2 C34.2 C35.2 C415.2 C416.1 J9.1(VEET) J9.10(VEER) J9.11(VEER) J9.14(VEER) J9.17(VEET) J9.20(VEET) Q1.2(SOURCE) Q2.2(SOURCE) R28.1 R29.1 R30.1 R31.2 R40.1 R41.1 R42.1 R59.2 R60.1 R61.1 R62.1 R65.1 U7.2(GND) U8.4(GND) U9.1(A0) U9.3(A2) U9.8(GND) U10.4(GND) U11.2(GND) U46.2(A1) U46.3(A2) U46.8(GND)
SH_GND: D14.3(GND) J10.1(SHIELD) J10.2(SHIELD) J10.3(SHIELD) J10.4(SHIELD) J10.5(SHIELD) J10.6(SHIELD) J10.7(SHIELD) J10.8(SHIELD) J10.9(SHIELD) J10.10(SHIELD) J10.11(SHIELD) J10.12(SHIELD) J10.13(SHIELD) J10.14(SHIELD) J10.15(SHIELD) J10.16(SHIELD) J10.17(SHIELD) J10.18(SHIELD) J10.19(SHIELD) J10.20(SHIELD)
HDMI_I2C_SCL: R23.1 U7.3(SCL) U8.6(SCL) U9.14(SCL) U10.2(SCLA) U46.14(SCL)
HDMI_I2C_SCL_BUF: D14.8(LINE-4) J9.5(SCL) R58.1 U10.7(SCLB)
HDMI_I2C_SDA: R24.1 U7.1(SDA) U8.5(SDA) U9.15(SDA) U10.3(SDAA) U46.15(SDA)
HDMI_I2C_SDA_BUF: D14.2(LINE-3) J9.4(SDA) R56.1 U10.6(SDAB)
HDMI_MGT_CLK_DE: U9.9(P4)
HDMI_MGT_CLK_RE_B: U9.10(P5)
HDMI_MGT_RX_N: J9.12(RD-)
HDMI_MGT_RX_P: J9.13(RD+)
HDMI_MGT_TX_N: J9.19(TD-)
HDMI_MGT_TX_P: J9.18(TD+)
HDMI_TRIGGER_0_DE: U9.7(P3)
HDMI_TRIGGER_0_RE_B: U9.6(P2)
HDMI_TRIGGER_1_DE: U9.5(P1)
HDMI_TRIGGER_1_RE_B: U9.4(P0)
SFP_ENABLE_B: D14.9(LINE-2) J9.3(TX_DIS) R35.1 R40.2 U46.5(P1)
SFP_I2C_EN: R65.2 U9.12(P7) U10.5(EN)
SFP_LED_GREEN: Q1.1(GATE) R61.2 U46.9(P4)
SFP_LED_YELLOW: Q2.1(GATE) R62.2 U46.10(P5)
SFP_MOD_ABS: D14.7(LINE-5) J9.6(MOD_ABS) R36.1 U46.6(P2)
SFP_POWER_EN: R59.1 U9.11(P6) U11.4(ON)
SFP_RS0: D14.4(LINE-6) J9.7(RS0) R32.1 R41.2 U46.7(P3)
SFP_RS1: D14.5(LINE-8) J9.9(RS1) R33.1 R42.2 U46.11(P6)
SFP_RX_LOS: D14.6(LINE-7) J9.8(RX_LOS) R37.1 U46.12(P7)
SFP_TX_FAULT: D14.1(LINE-1) J9.2(TX_FAULT) R34.1 U46.4(P0)
TEMP_ALERT: R49.1 TP8.1 U7.4(OT)
NetC29_1: C29.1 C32.1 L1.1 L2.1 R57.1 TP9.1 U11.1(OUT)
NetC30_1: C30.1 C31.1 J9.15(VCCR) L1.2
NetC33_1: C33.1 C34.1 J9.16(VCCT) L2.2
NetD6_1: D6.1 Q1.3(DRAIN)
NetD6_2: D6.2 R38.1
NetD7_1: D7.1 Q2.3(DRAIN)
NetD7_2: D7.2 R39.1
NetR25_2: R25.2 R29.2 U8.1(A0)
NetR26_2: R26.2 R30.2 U8.2(A1)
NetR27_1: R27.1 R31.1 U8.3(A2)
NetR28_2: R28.2 U8.7(WP)
NetR60_2: R60.2 U11.3(SETI)
NetR64_1: R64.1 U9.13(~{INT})
NetR539_1: R539.1 U46.13(~{INT})

Not connected (* = marked no-connect by the designer): U11 6(~{FLAG})*

### Layout directives
net class P-G: NetC29_1, NetC30_1, NetC33_1
differential pair; differential pair class 100DIFF: HDMI_MGT_RX_N, HDMI_MGT_RX_P, HDMI_MGT_TX_N, HDMI_MGT_TX_P

### Notes on the sheet
- 100uA
- I2C ADDRESS: 0x39
- I2C ADDRESS: 0x49
- (near U9) I2C ADDRESS: 0x3A
- I2C ADDRESS: 0xA0, 0xA2
- I2C ADDRESS: 0x54
- SCHEMATIC,
- "This documentation describes Open Hardware and is licensed under the CC BY-SA 4.0. You may redistribute and modify this documentation under the terms of
- CC BY-SA 4.0. (https://creativecommons.org/licenses/by-sa/4.0/). This documentation is distributed WITHOUT ANY EXPRESS OR IMPLIED WARRANTY,
- INCLUDING OF MERCHANTABILITY, SATISFACTORY QUALITY AND FITNESS FOR A PARTICULAR PURPOSE."  COPYRIGHT ©
- Atom Computing, Inc.
- ,
- SIZE
- FILE NAME
- PAGE
- OF
- REV

### Library data of the parts
C5 C8 C23 C27 = CMP-001-00143-7: CAP CER 0.1UF 25V X7R 0603; Mfg: Kemet; Tolerance: 10%; Mfg PN: C0603X104K3RACTU; Voltage: 25V; Pins: 2; VALUE: 100nF; Case/Package: 0603; Temp Coeff: X7R
C6 C7 C24 C28 = CMP-001-00135-7: as C1 on sheet HDMI_CONN_POWER_IN; VALUE: 1µF; Voltage: 10V; Tolerance: 10%; Case/Package: 0603; Pins: 2
C25 = CMP-001-00168-8: CAP CER 10000PF 50V C0G 0603; Mfg PN: C1608C0G1H103J080AA; Mfg: TDK Corporation; Tolerance: 5%; Temp Coeff: C0G/NP0; VALUE: 10nF; Voltage: 50V; Case/Package: 0603; Pins: 2
C26 C35 = CMP-001-00135-7: CAP CER 1uF 10V 10% 0603; Mfg PN: C0603C105K8PACTU; Mfg: Kemet; Temp Coeff: X5R; Op Temp: -55°C ~ 85°C; VALUE: 1µF; Tolerance: 10%; Voltage: 10V; Case/Package: 0603; Pins: 2
C29 C31 C32 C34 C415 = CMP-001-00143-7: CAP CER 0.1UF 25V X7R 0603; Mfg PN: C0603X104K3RACTU; Mfg: Kemet; Tolerance: 10%; VALUE: 100nF; Case/Package: 0603; Pins: 2; Temp Coeff: X7R; Voltage: 25V
C30 C33 = CMP-001-00066-8: CAP CER 22UF 10V X7R 1206; Mfg PN: GRM31CR71A226KE15L; Mfg: MURATA; Tolerance: 10%; VALUE: 22µF; Voltage: 10V; Pins: 2; Temp Coeff: X7R; Case/Package: 1206
C416 = CMP-001-00173-8: ±10% 35V Ceramic Capacitor X7R 0603 (1608 Metric); Mfg: TDK Corporation; Mfg PN: C1608X7R1V105K080AE; VALUE: 1µF; Pins: 2; Temp Coeff: X7R; Case/Package: 0603
D6 = CMP-004-00020-5: LED GREEN CLEAR CHIP SMD R/A; Mfg: AVAGO TECHNOLOGIES; Mfg PN: HSME-C120; Forward Voltage: 2.1V; Value: GREEN; Case/Package: 2-SMD; Pins: 2; Mounting Technology: Surface Mount; Nominal Vf: 2.1V; RoHS Compliant: Yes
D7 = CMP-007-00001-2: LED AMBER CLEAR CHIP SMD R/A 0603; Mfg: Broadcom Limited; Nominal Vf: 1.9V; Forward Current: 25mA; Forward Voltage: 2.4V; Mfg PN: HSMA-C120; Mounting Technology: Surface Mount; RoHS Compliant: Yes; Case/Package: 0603; Max Operating Temperature: 85°C; Min Operating Temperature: -30°C; Pins: 2; Value: AMBER
D14 = CMP-0037-00000-1: TVS DIODE 3.3VWM 10V U-DFN3810-9; Voltage - Breakdown: 5V; Mfg: Diodes Incorporated; Current - Peak Pulse: 5.5A (8/20µs); Voltage - Reverse Standoff: 3.3V; Case/Package: 9-UDFN; Mfg PN: DT1240A-08LP3810-7; Mounting Technology: Surface Mount; Max Operating Temperature: 85°C; Voltage - Clamping: 10V; RoHS Compliant: Yes; Min Operating Temperature: -55°C; Pins: 9
J9 = CMP-002-00059-2: 20 Position SFP+ Receptacle Connector Solder Surface Mount, Right Angle; Gender: Female; Mfg: Amphenol ICC (Commercial Products); Mounting Technology: Surface Mount; Mfg PN: UE76-A20-2000T; Connector Type: SFP+; Case/Package: 0.8mm; Pins: 20; RoHS Compliant: Yes
J10 = CMP-002-00063-3: Position SFP+ Cage Connector Solder Through Hole, Right Angle; Mfg: TE Connectivity AMP Connectors; RoHS Compliant: Yes; Pins: 20; Connector Type: SFP+ Cage; Case/Package: None; Mfg PN: 2110304-1
L1 L2 = CMP-006-00015-5: FIXED IND 4.7UH 3.2A 81.3 MOHM; Mfg PN: IHLP2020BZER4R7M11; Mfg: Vishay Dale; Tolerance: 20%; Self Resonant Frequency: 27MHz; DCR: 81.3m; Saturation Current: 3A; VALUE: 4.7µH; Pins: 2; Case/Package: SMD; Min Operating Temperature: -55°C; Current Rating: 3.2A; Max Operating Temperature: 125°C; Mounting Technology: Surface Mount; Height: 2.0mm
Q1 Q2 = CMP-479-000010-1: MOSFET N-CH 50V 210MA SC70; Current Rating: 0.210A; Mfg: ON SEMICONDUCTOR; Mfg PN: BSS138W; Voltage: 50V; Pin Count: 3; Package: SC70
R23 R24 R28 R49 R56 R58 R61 R62 R64 R65 R539 = CMP-009-00475-2: RES SMD 10K OHM 1% 1/10W 0603; Mfg PN: ERJ-3EKF1002V; Mfg: Panasonic Electronic Components; Power: 100mW; VALUE: 10k; Tolerance: 1%; Mounting Technology: Surface Mount; Min Operating Temperature: -55°C; Max Operating Temperature: 155°C; Case/Package: 0603; Pins: 2; RoHS Compliant: Yes
R25 R26 R31 R40-R42 R57 = CMP-009-00057-4: DNP, RES 0603; Mfg PN: DNP_RES_0603; Mfg: DNP; VALUE: DNP; Case/Package: 0603; Pins: 2
R27 R29 R30 = CMP-009-00290-2: as R5 on sheet HDMI_CONN_POWER_IN; VALUE: 0; Pins: 2; Case/Package: 0603
R32-R37 = CMP-009-00307-2: RES SMD 4.7K OHM 1% 1/10W 0603; Mfg PN: RC0603FR-074K7L; Mfg: Yageo; VALUE: 4.7k; Case/Package: 0603; Pins: 2
R38 = CMP-009-00297-2: RES SMD 220 OHM 1% 1/10W 0603; Mfg: Yageo; Mfg PN: RC0603FR-07220RL; Case/Package: 0603; VALUE: 220; Pins: 2
R39 = CMP-009-00554-1: RES SMD 280 OHM 1% 1/10W 0603; Mfg: Panasonic Electronic Components; Mfg PN: ERJ-3EKF2800V; Power: 100mW; Case/Package: 0603; Value: 280; Pins: 2; RoHS Compliant: Yes; Mounting Technology: Surface Mount; Min Operating Temperature: -55°C; Max Operating Temperature: 155°C; Tolerance: 1%
R59 = CMP-009-00475-2: as R8 on sheet HDMI_CONN_POWER_IN; VALUE: 10k; Case/Package: 0603; RoHS Compliant: Yes; Pins: 2; Max Operating Temperature: 155°C; Min Operating Temperature: -55°C; Tolerance: 1%; Mounting Technology: Surface Mount
R60 = CMP-009-00432-2: RES SMD 52.3K 0.1% 1/10W 0603; Mfg PN: RT0603BRD0752K3L; Mfg: Yageo; Case/Package: 0603; VALUE: 52.3k; Pins: 2
TP8 TP9 = CMP-00030-00002-6: as TP1 on sheet HDMI_CONN_POWER_IN; Pins: 1; Value: White
U7 = CMP-010-00002-3: Temperature Sensor Digital, Local -55°C ~ 125°C 12 b SOT-6; Mfg: Maxim; Max Supply Voltage: 5.5V; Sensor Type: TEMPERATURE SENSOR,SWITCH/DIGITAL OUTPUT,SERIAL; Min Supply Voltage: 3V; Mfg PN: MAX6626PMUT+T; Max Operating Temperature: 125°C; RoHS Compliant: Yes; Case/Package: SOT-23-6; Min Operating Temperature: -55°C; Mounting Technology: Surface Mount; Pins: 6
U8 = CMP-019-00010-2: IC EEPROM  MAC 48 2KBIT I2C 1MHZ 8TSSOP; Mfg: Microchip Technology; Min Supply Voltage: 1.7V; Memory Size: 256; Max Supply Voltage: 5.5V; Mfg PN: AT24MAC402-XHM-B; Max Operating Temperature: 85°C; Clock Frequency: 1MHz; Mounting Technology: Surface Mount; Case/Package: TSSOP; Pins: 8; Min Operating Temperature: -40°C; Memory Format: EEPROM; RoHS Compliant: Yes
U9 U46 = CMP-015-00018-4: I/O GPIO Expander 8 I2C, SMBus 400 kHz 16-SO; Max Supply Voltage: 5.5V; Min Supply Voltage: 2.3V; Nominal Supply Voltage: 3V; Mfg: NXP USA Inc.; RoHS Compliant: Yes; Min Operating Temperature: -40°C; Max Operating Temperature: 85°C; Mfg PN: PCA9554AD,118; Mounting Technology: Surface Mount; Pins: 16; Case/Package: 16-SOIC
U10 = CMP-015-00020-1: Voltage Level Translator Bidirectional 1 Circuit 2 Channel 8-SOIC; Max Supply Voltage: 5.5V; Min Supply Voltage: 900mV; Nominal Supply Voltage: 3.3V; Mfg: Texas Instruments; Case/Package: 8-SOIC; Mfg PN: TCA9517DR; RoHS Compliant: Yes; Max Operating Temperature: 85°C; Mounting Technology: Surface Mount; Min Operating Temperature: -40°C; Pins: 8
U11 = CMP-035-00005-1: IC CURRENT SWITCH ADJ 10% SOT-23-6; Max Supply Voltage: 5.5V; Min Supply Voltage: 1.7V; Mfg: Analog Devices Inc./Maxim Integrated; Mfg PN: MAX4995BAUT+T; Case/Package: SOT-23-6; RoHS Compliant: Yes; Min Operating Temperature: -40°C; Max Operating Temperature: 125°C; Mounting Technology: Surface Mount; Pins: 6

## Nets that join several sheets
+3.3V_SW: HDMI_CONN_POWER_IN (C11.1 R7.2 TP3.1 U1.6), CLOCK_TRIGGER_BUF_SMA (19 pins), SFP_TEMP_EEPROM_GPIO (42 pins)
GND: HDMI_CONN_POWER_IN (23 pins), CLOCK_TRIGGER_BUF_SMA (31 pins), SFP_TEMP_EEPROM_GPIO (49 pins)
SH_GND: BLOCK_DIAGRAM_TABLE_OF_SHEETS (MH1.1 MH2.1 MH3.1 MH4.1), HDMI_CONN_POWER_IN (12 pins), CLOCK_TRIGGER_BUF_SMA (36 pins), SFP_TEMP_EEPROM_GPIO (21 pins)
HDMI_I2C_SCL: HDMI_CONN_POWER_IN (J1.15 TP1.1), SFP_TEMP_EEPROM_GPIO (6 pins)
HDMI_I2C_SDA: HDMI_CONN_POWER_IN (J1.16 TP2.1), SFP_TEMP_EEPROM_GPIO (6 pins)
HDMI_MGT_CLK_DE: CLOCK_TRIGGER_BUF_SMA (R48.2 U5.3), SFP_TEMP_EEPROM_GPIO (U9.9)
HDMI_MGT_CLK_N: HDMI_CONN_POWER_IN (D4.5 D4.6 J1.12), CLOCK_TRIGGER_BUF_SMA (R46.1 U5.7)
HDMI_MGT_CLK_P: HDMI_CONN_POWER_IN (D4.4 D4.7 J1.10), CLOCK_TRIGGER_BUF_SMA (R46.2 U5.6)
HDMI_MGT_CLK_RE_B: CLOCK_TRIGGER_BUF_SMA (R55.1 U5.2), SFP_TEMP_EEPROM_GPIO (U9.10)
HDMI_MGT_RX_N: HDMI_CONN_POWER_IN (D4.2 D4.9 J1.9), SFP_TEMP_EEPROM_GPIO (J9.12)
HDMI_MGT_RX_P: HDMI_CONN_POWER_IN (D4.1 D4.10 J1.7), SFP_TEMP_EEPROM_GPIO (J9.13)
HDMI_MGT_TX_N: HDMI_CONN_POWER_IN (D3.1 D3.10 J1.6), SFP_TEMP_EEPROM_GPIO (J9.19)
HDMI_MGT_TX_P: HDMI_CONN_POWER_IN (D3.2 D3.9 J1.4), SFP_TEMP_EEPROM_GPIO (J9.18)
HDMI_TRIGGER_0_DE: CLOCK_TRIGGER_BUF_SMA (R43.2 U2.3), SFP_TEMP_EEPROM_GPIO (U9.7)
HDMI_TRIGGER_0_N: HDMI_CONN_POWER_IN (D3.5 D3.6 J1.3), CLOCK_TRIGGER_BUF_SMA (R44.2 U2.6)
HDMI_TRIGGER_0_P: HDMI_CONN_POWER_IN (D3.4 D3.7 J1.1), CLOCK_TRIGGER_BUF_SMA (R44.1 U2.7)
HDMI_TRIGGER_0_RE_B: CLOCK_TRIGGER_BUF_SMA (R53.1 U2.2), SFP_TEMP_EEPROM_GPIO (U9.6)
HDMI_TRIGGER_1_DE: CLOCK_TRIGGER_BUF_SMA (R47.2 U4.3), SFP_TEMP_EEPROM_GPIO (U9.5)
HDMI_TRIGGER_1_N: HDMI_CONN_POWER_IN (D5.2 D5.9 J1.19), CLOCK_TRIGGER_BUF_SMA (R45.2 U4.6)
HDMI_TRIGGER_1_P: HDMI_CONN_POWER_IN (D5.1 D5.10 J1.14), CLOCK_TRIGGER_BUF_SMA (R45.1 U4.7)
HDMI_TRIGGER_1_RE_B: CLOCK_TRIGGER_BUF_SMA (R54.1 U4.2), SFP_TEMP_EEPROM_GPIO (U9.4)